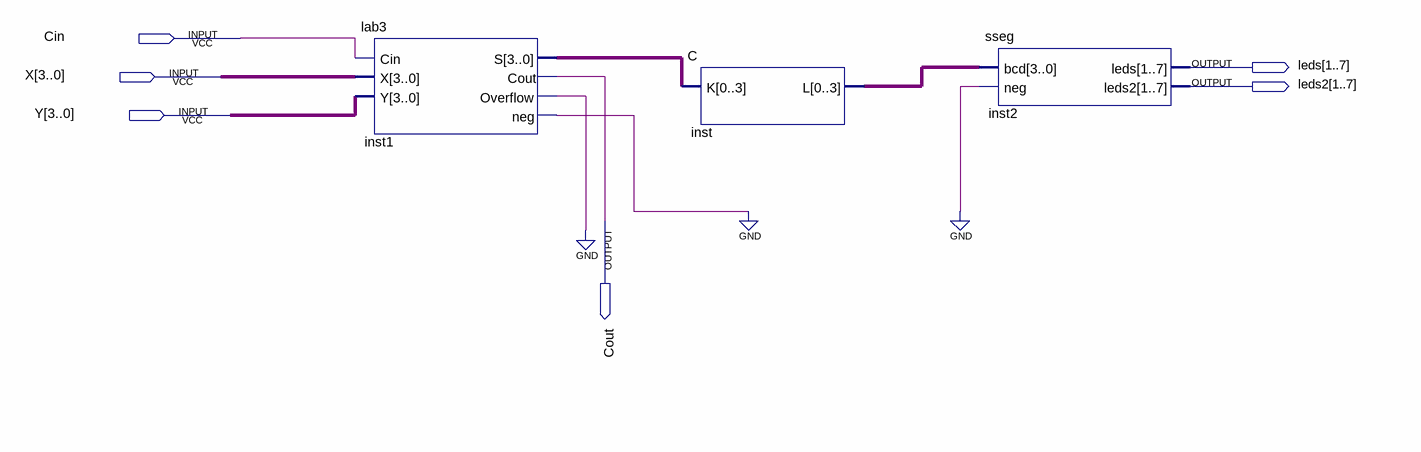
[diagram p0: schematic sheet]
// Quartus schematic combineASU2.bdf as structural Verilog: 3 symbols, 6 pins
module combineASU2 (
  input  Cin,
  input  [3:0] X,
  input  [3:0] Y,
  output [1:7] leds,
  output [1:7] leds2,
  output Cout
);

  wire inst1_neg, inst1_overflow;
  wire [3:0] inst1_s, inst_l;

  lab3 inst1 (.Cin(Cin), .X(X), .Y(Y), .S(inst1_s), .Cout(Cout), .Overflow(inst1_overflow), .neg(inst1_neg));
  C inst (.K(inst1_s), .L(inst_l));
  sseg inst2 (.bcd(inst_l), .neg(1'b0), .leds(leds), .leds2(leds2));
  // also tied to GND on the sheet: {inst1_overflow, inst1_neg}
endmodule
